# EAGLE design dht21 (EAGLE 8.1.0)
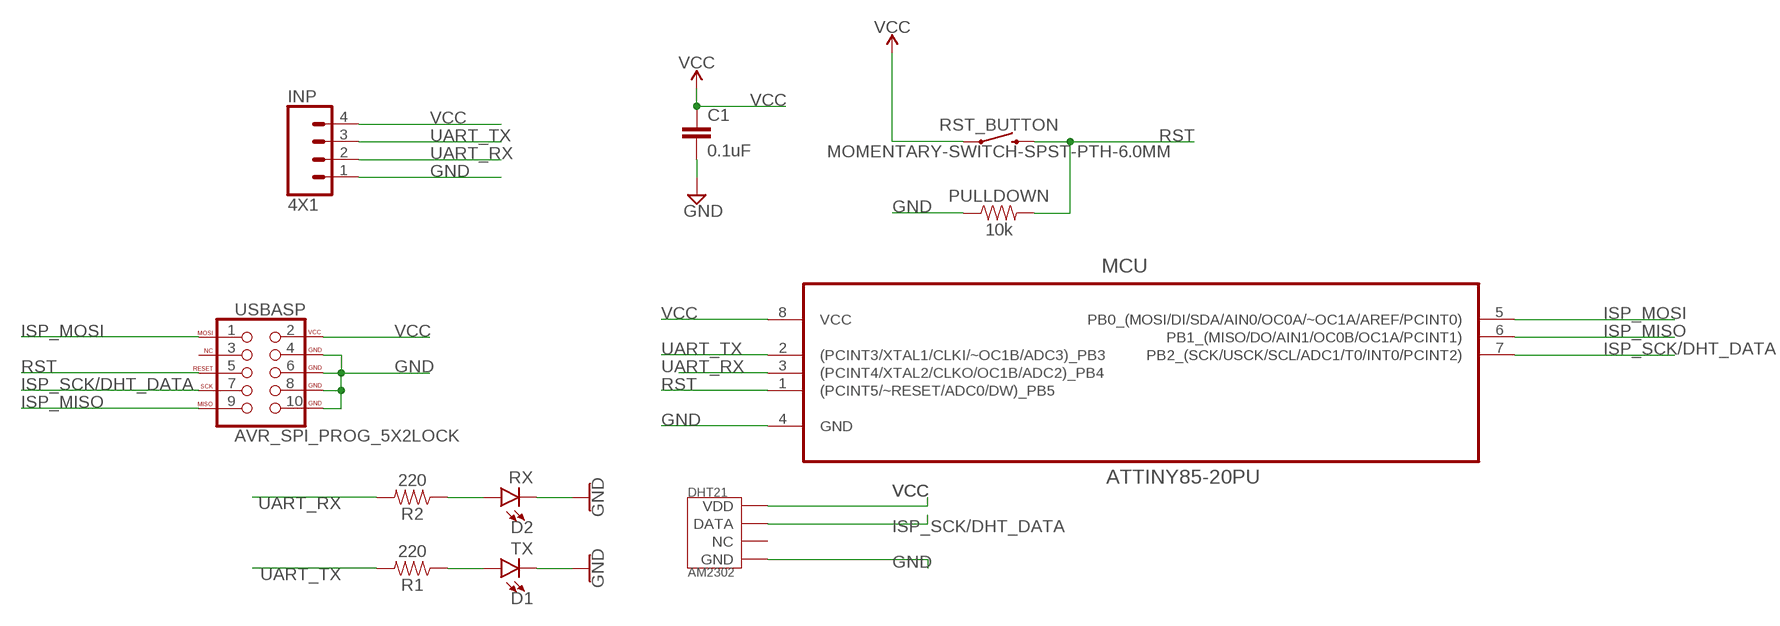
[diagram p0: schematic, sheet 1]

## Parts
C1  0.1uF  0.1UF-KIT-EZ-50V-20%  [CAP-PTH-SMALL-KIT]
D1  TX  LED3MM  [LED_3MM]
D2  RX  LED3MM  [LED_3MM]
DHT21  AM2302  TEM-HUM-AM2302(4P-25.0X15.0MM)  [SNR4-2.54-25.0X15.0X7.0MM]
INP  4X1  CONN_04  [1X04]
MCU  ATTINY85-20PU  [DIP254P762X533-8]
PULLDOWN  10k  10KOHM-HORIZ-1/4W-1%  [AXIAL-0.3]
R1  220  RESISTORAXIAL-0.3  [AXIAL-0.3]
R2  220  RESISTORAXIAL-0.3  [AXIAL-0.3]
RST_BUTTON  MOMENTARY-SWITCH-SPST-PTH-6.0MM  [TACTILE_SWITCH_PTH_6.0MM]
USBASP  AVR_SPI_PROG_5X2LOCK  [2X5-SHROUDED_LOCK]

## Nets
GND: C1.2 D1.K(C) D2.K(C) DHT21.P$4(GND) INP.1 MCU.4(GND) PULLDOWN.P$1 USBASP.4(GND) USBASP.6(GND) USBASP.8(GND) USBASP.10(GND)
ISP_MISO: MCU.6(PB1_(MISO/DO/AIN1/OC0B/OC1A/PCINT1)) USBASP.9(MISO)
ISP_MOSI: MCU.5(PB0_(MOSI/DI/SDA/AIN0/OC0A/~OC1A/AREF/PCINT0)) USBASP.1(MOSI)
ISP_SCK/DHT_DATA: DHT21.P$2(DATA) MCU.7(PB2_(SCK/USCK/SCL/ADC1/T0/INT0/PCINT2)) USBASP.7(SCK)
N$1: D1.A R1.P$1
N$2: D2.A R2.P$1
RST: MCU.1((PCINT5/~RESET/ADC0/DW)_PB5) PULLDOWN.P$2 RST_BUTTON.3 USBASP.5(RESET)
UART_RX: INP.2 MCU.3((PCINT4/XTAL2/CLKO/OC1B/ADC2)_PB4) R2.P$2
UART_TX: INP.3 MCU.2((PCINT3/XTAL1/CLKI/~OC1B/ADC3)_PB3) R1.P$2
VCC: C1.1 DHT21.P$1(VDD) INP.4 MCU.8(VCC) RST_BUTTON.1 USBASP.2(VCC)
Unconnected: DHT21.P$3(NC) USBASP.3(NC)

## Library data of the parts
C1 = SparkFun-Capacitors:0.1UF: 0.1µF ceramic capacitors A capacitor is a passive two-terminal electrical component used to store electrical energy temporarily in an electric field.; PROD_ID: CAP-08370
D1 D2 = SparkFun-LED:LED: LED (Generic) Standard schematic elements and footprints for 5mm, 3mm, 1206, and 0603 sized LEDs. Generic LEDs with no color specified.; PROD_ID: DIO-08794
DHT21 = Seeed-OPL-sensor:TEM-HUM-AM2302(4P-25.0X15.0MM): 314010001; MPN: AM2302
INP = SparkFun-Connectors:CONN_04: Multi connection point. Often used as Generic Header-pin footprint for 0.1 inch spaced/style header connections On any of the 0.1 inch spaced packages, you can populate with these: Break Away Headers - Straight <https://www.sparkfun.com/products/116> (PRT-00116) Break Away Male Headers - Right Angle <https://www.sparkfun.com/products/553> (PRT-00553) Female Headers <https://www.sparkfun.com/products/115> (PRT-00115) Break Away Headers - Machine Pin <https://www.sparkfun.com/products/117> (PRT-00117) Break Away Female Headers - Swiss Machine Pin <https://www.sparkfun.com/products/743> (PRT-00743) For SCREWTERMINALS and SPRING TERMINALS visit here: Screw Terimnals on SparkFun.com <https://www.sparkfun.com/search/results?term=Screw+Terminals> (5mm/3.5mm/2.54mm spacing) This device is also useful as a general connection point to wire up your design to another part of your project. Our various solder wires solder well into these plated through hole pads. Hook-Up Wire - Assortment (Stranded, 22 AWG) <https://www.sparkfun.com/products/11375> (PRT-11375) Hook-Up Wire - Assortment (Solid Core, 22 AWG) <https://www.sparkfun.com/products/11367> (PRT-11367) View the entire wire category on our website here <https://www.sparkfun.com/categories/141> Special notes: Molex polarized connector foot print use with SKU : PRT-08231 with associated crimp pins and housings. 1MM SMD Version SKU: PRT-10208; PROD_ID: CONN-09696
MCU = Atmel_By_element14_Batch_1-00:ATTINY85-20PU: 8-bit Microcontroller with In-System Programmable Flash; MPN: ATTINY85-20PU; OC_FARNELL: 1455162; OC_NEWARK: 58M3796; PACKAGE: PDIP-8; SUPPLIER: Atmel
PULLDOWN = SparkFun-Resistors:10KOHM: 10kΩ resistor A resistor is a passive two-terminal electrical component that implements electrical resistance as a circuit element. Resistors act to reduce current flow, and, at the same time, act to lower voltage levels within circuits. - Wikipedia; PROD_ID: RES-12183
R1 R2 = SparkFun-Resistors:RESISTOR: Generic Resistor Package
RST_BUTTON = SparkFun-Switches:MOMENTARY-SWITCH-SPST: Momentary Switch (Pushbutton) - SPST Normally-open (NO) SPST momentary switches (buttons, pushbuttons). Variants PTH-12MM - 12mm square, through-hole Momentary Pushbutton Switch - 12mm Square <https://www.sparkfun.com/products/9190> (COM-09190) PTH-6.0MM, PTH-6.0MM-KIT - 6.0mm square, through-hole Mini Pushbutton Switch <https://www.sparkfun.com/products/97> (COM-00097) KIT package intended for soldering kit's - only one side of pads' copper is exposed. PTH-RIGHT-ANGLE-KIT - Right-angle, through-hole Right Angle Tactile Button <https://www.sparkfun.com/products/10791> - Used on SparkFun BigTime Watch Kit <https://www.sparkfun.com/products/11734> SMD-12MM - 12mm square, surface-mount Tactile Button - SMD (12mm) <https://www.sparkfun.com/products/12993> (COM-12993) Used on SparkFun PicoBoard <https://www.sparkfun.com/products/11888> SMD-4.5MM - 4.5mm Square Trackball Switch Used on SparkFun Blackberry Trackballer Breakout <https://www.sparkfun.com/products/13169> SMD-4.6MMX2.8MM - 4.60mm x 2.80mm, surface mount Used on SparkFun SAMD21 Mini Breakout <https://www.sparkfun.com/products/13664> SMD-5.2MM, SMD-5.2-REDUNDANT - 5.2mm square, surface-mount Mini Pushbutton Switch - SMD <https://www.sparkfun.com/products/8720> (COM-08720) Used on Arduino Pro Mini <https://www.sparkfun.com/products/11114> REDUNDANT package connects both switch circuits together SMD-6.0X3.5MM - 6.0 x 3.5mm, surface mount Momentary Reset Switch SMD <https://www.sparkfun.com/products/8229> (COM-08229) SMD-6.2MM-TALL - 6.2mm square, surface mount Tactile Button - SMD (6mm) <https://www.sparkfun.com/products/12992> Used on SparkFun Digital Sandbox <https://www.sparkfun.com/products/12651> SMD-RIGHT-ANGLE - Right-angle, surface mount Used on SparkFun Block for Intel® Edison - Arduino <https://www.sparkfun.com/products/13036>; PROD_ID: SWCH-08441; SF_SKU: COM-00097
USBASP = SparkFun-Connectors:AVR_SPI_PROG_5X2: AVR 10-pin ICSP Header This is the standard AVR In Circuit Serial Programming header. Minimal, but includes pin one indicator. Works with standard Olimex programmers. SparkFun Products: 2x5 AVR ICSP Male Header <https://www.sparkfun.com/products/778> - PTH 2x5 Pin Shrouded Header <https://www.sparkfun.com/products/8506> - PTH2; PROD_ID: CONN-08671; SF_ID: PRT-08506

## Board
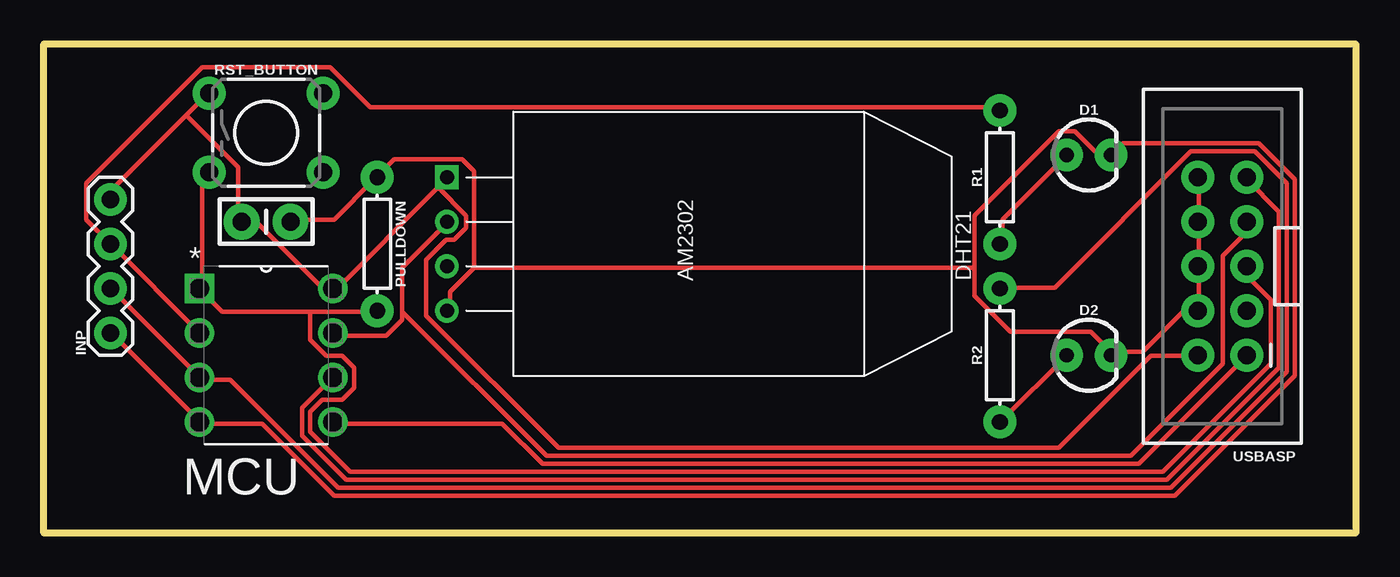
[diagram p1: board, top side]
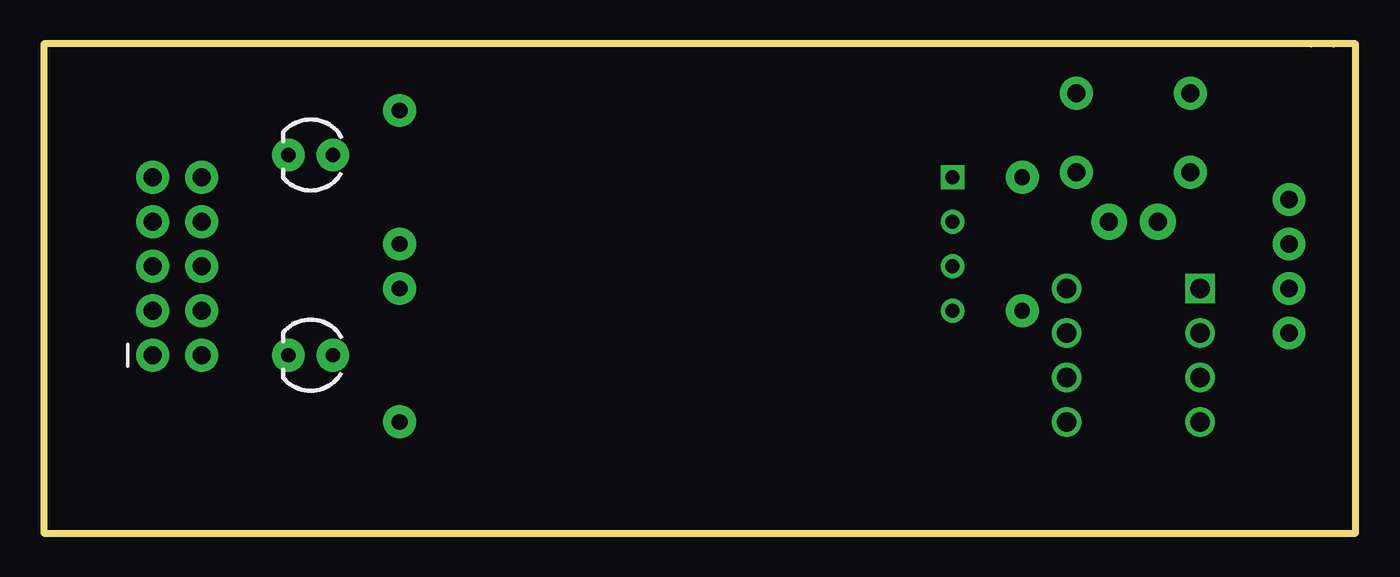
[diagram p2: board, bottom side, seen from below]

Size 74.93 x 27.94 mm. Coordinates in mm from the lower left corner, seen from the top.
Outline: 1.27,27.94 2.54,27.94 74.93,27.94 74.93,0 0,0 0,27.94 1.27,27.94
Copper layers (1*16): Top 0.035mm / dielectric 1.5mm / Bottom 0.035mm
Design rules "default": minimum track width 10mil, minimum drill 24mil, track to track 8mil, track to pad 8mil, pad to pad 8mil, via to via 8mil, smd to smd 8mil, copper to edge 40mil, drill to drill 8mil, minimum pad ring 10mil, minimum via ring 8mil, stop-mask expansion 4mil, vias tented up to drill 0mil, thermal gap 10mil

### Footprints (pad centres in the part's own frame; a part is rotated, then mirrored left to right if it is on the bottom)
CAP-PTH-SMALL-KIT = drill 1.016 pad 2.032: 1 -1.397,0; 2 1.397,0
LED_3MM = drill 0.813 pad 1.88: A -1.27,0; K 1.27,0
SNR4-2.54-25.0X15.0X7.0MM = drill 0.8 pad 1.35 square: P$1 -3.81,-13.8 | drill 0.8 pad 1.35: P$2 -1.27,-13.8; P$3 1.27,-13.8; P$4 3.81,-13.8
1X04 = drill 1.016 pad 1.88: 1 0,0; 2 2.54,0; 3 5.08,0; 4 7.62,0
DIP254P762X533-8 = drill 1.118 square: 1 -7.62,7.62 | drill 1.118: 2 -7.62,5.08; 3 -7.62,2.54; 4 -7.62,0; 5 0,0; 6 0,2.54; 7 0,5.08; 8 0,7.62
AXIAL-0.3 = drill 0.9 pad 1.88: P$1 -3.81,0; P$2 3.81,0
TACTILE_SWITCH_PTH_6.0MM = drill 1.016 pad 1.88: 1 -3.251,2.261; 2 3.251,2.261; 3 -3.251,-2.261; 4 3.251,-2.261
2X5-SHROUDED_LOCK = drill 1.016 pad 1.88: 1 -1.397,5.08; 2 1.397,5.08; 3 -1.397,2.54; 4 1.397,2.54; 5 -1.397,0; 6 1.397,0; 7 -1.397,-2.54; 8 1.397,-2.54; 9 -1.397,-5.08; 10 1.397,-5.08

### Placement (x,y rotation side)
C1  12.7,17.78 0 top
D1  59.69,21.59 0 top
D2  59.69,10.16 0 top
DHT21  36.83,16.51 270 top
INP  3.81,11.43 90 top
MCU  16.51,6.35 0 top
PULLDOWN  19.05,16.51 270 top
R1  54.61,20.32 90 top
R2  54.61,10.16 90 top
RST_BUTTON  12.7,22.86 0 top
USBASP  67.31,15.24 180 top

### Tracks (layer width: path | path; a pad name or v marks a point on that pad's centre or on a via)
GND
  Top 0.254: 24.59,15.16 23.22,13.79 23.22,12.88 DHT21.P$4 | 24.59,15.16 24.59,20.65 23.9,21.34 20.02,21.34 19.1,20.42 PULLDOWN.P$1 18.87,20.19 16.59,17.91 14.3,17.91 C1.2 | INP.1 4.01,11.28 8.81,6.48 MCU.4 9.04,6.25 12.47,6.25 16.59,2.13 64.59,2.13 71.45,8.99 71.45,20.19 69.39,22.25 61.62,22.25 D1.K 60.94,21.79 60.02,21.79 58.88,22.94 57.96,22.94 53.16,18.14 53.16,15.16 | USBASP.10 65.96,20.19 65.96,17.91 USBASP.8 65.96,17.68 65.96,15.39 USBASP.6 65.96,15.16 65.96,12.88 USBASP.4 65.73,12.65 65.05,12.65 62.76,10.36 61.16,10.36 D2.K 60.94,10.36 59.79,11.51 55.22,11.51 53.16,13.56 53.16,15.16 | 53.16,15.16 24.59,15.16
ISP_MISO
  Top 0.254: MCU.6 16.36,8.76 14.76,7.16 14.76,5.56 17.27,3.05 64.14,3.05 70.54,9.45 70.54,18.36 68.71,20.19 USBASP.9
ISP_MOSI
  Top 0.254: MCU.5 16.59,6.25 26.19,6.25 28.47,3.96 62.54,3.96 68.71,10.13 USBASP.1
ISP_SCK/DHT_DATA
  Top 0.254: 20.47,12.65 20.47,12.19 19.56,11.28 16.59,11.28 MCU.7 | 20.47,12.65 20.47,15.16 22.99,17.68 DHT21.P$2 | USBASP.7 68.71,17.22 67.33,15.85 67.33,9.68 62.08,4.42 28.7,4.42 20.47,12.65
N$1
  Top 0.254: R1.P$1 54.76,16.53 54.76,17.91 58.42,21.56 D1.A
N$2
  Top 0.254: R2.P$1 54.76,6.48 58.42,10.13 D2.A
RST
  Top 0.254: RST_BUTTON.3 9.04,20.19 9.04,14.02 MCU.1 9.04,13.79 10.18,12.65 15.21,12.65 | 15.21,12.65 18.87,12.65 PULLDOWN.P$2 | USBASP.5 68.71,14.71 70.08,13.34 70.08,9.68 63.91,3.5 17.5,3.5 15.21,5.79 15.21,6.93 15.9,7.62 17.04,7.62 17.73,8.31 17.73,9.45 17.04,10.13 16.13,10.13 15.21,11.05 15.21,12.65
UART_RX
  Top 0.254: INP.2 4.01,13.79 8.81,8.99 MCU.3 9.04,8.76 10.64,8.76 16.82,2.59 64.36,2.59 70.99,9.22 70.99,19.96 69.16,21.79 65.51,21.79 57.73,14.02 54.76,14.02 R2.P$2
UART_TX
  Top 0.254: MCU.2 INP.3 2.41,17.91 2.41,19.96 9.04,26.59 16.36,26.59 18.64,24.31 54.53,24.31 R1.P$2
VCC
  Top 0.254: 8.13,23.85 9.27,24.99 RST_BUTTON.1 | 8.13,23.85 4.01,19.74 4.01,19.05 INP.4 | 22.53,19.74 16.59,13.79 MCU.8 16.36,14.02 15.9,14.02 12.24,17.68 11.33,17.68 C1.1 11.1,17.91 11.1,20.88 8.13,23.85 | 22.53,19.74 22.99,20.19 DHT21.P$1 22.53,19.74 | 22.53,19.74 24.13,18.14 24.13,17.45 23.44,16.76 22.99,16.76 21.84,15.62 21.84,12.42 29.39,4.88 57.96,4.88 63.22,10.13 65.73,10.13 USBASP.2